# EAGLE schematic Electronics_schematic_v4 (EAGLE 9.7.0)
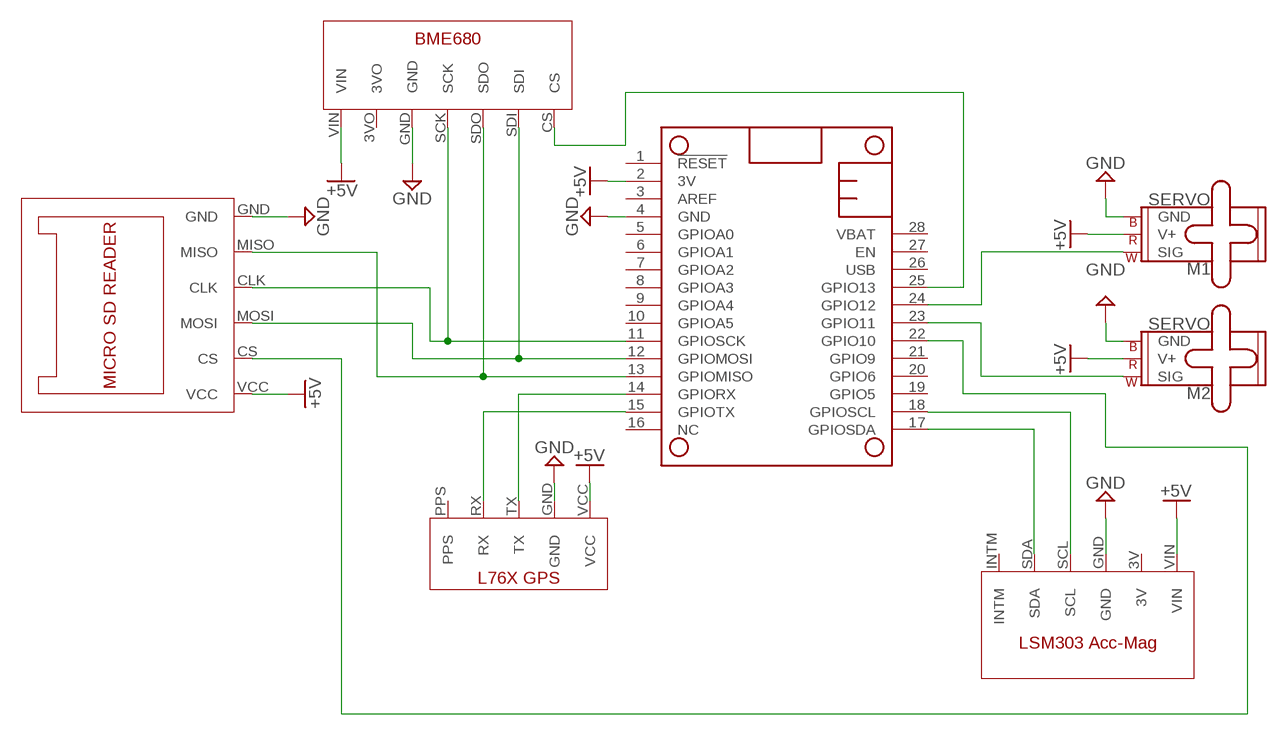
[diagram p0: schematic, sheet 1]

## Parts
M1  SERVO  [1X03]
M2  SERVO  [1X03]
MS1  FEATHERWING_NODIM  [FEATHERWING_DIM]
U$1  BME680  [BME680]
U$2  L76XGPS  [L76XGPS]
U$3  LSM303-ACC-MAG  [LSM303]
U$4  SD-READER  [SD-READER]

## Nets
+5V: M1.2(V+) M2.2(V+) MS1.2(3V) U$1.VIN U$2.VCC U$3.VIN
GND: M1.3(GND) M2.3(GND) MS1.4(GND) U$1.GND U$2.GND U$3.GND U$4.GND
N$1: MS1.11(GPIOSCK) U$1.SCK U$4.CLK
N$2: MS1.13(GPIOMISO) U$1.SDO U$4.MISO
N$3: MS1.12(GPIOMOSI) U$1.SDI U$4.MOSI
N$4: MS1.25(GPIO13) U$1.CS
N$5: MS1.14(GPIORX) U$2.TX
N$6: MS1.15(GPIOTX) U$2.RX
N$7: MS1.17(GPIOSDA) U$3.SDA
N$8: MS1.18(GPIOSCL) U$3.SCL
N$9: M1.1(SIG) MS1.24(GPIO12)
N$10: M2.1(SIG) MS1.23(GPIO11)
N$11: MS1.22(GPIO10) U$4.CS
VCC: U$4.VCC ; supply symbol labelled +5V
Unconnected: MS1.1(!RESET) MS1.3(AREF) MS1.5(GPIOA0) MS1.6(GPIOA1) MS1.7(GPIOA2) MS1.8(GPIOA3) MS1.9(GPIOA4) MS1.10(GPIOA5) MS1.16(NC) MS1.19(GPIO5) MS1.20(GPIO6) MS1.21(GPIO9) MS1.26(USB) MS1.27(EN) MS1.28(VBAT) U$1.3VO U$2.PPS U$3.3V U$3.INTM

## Library data of the parts
M1 M2 = SparkFun-Electromechanical:SERVO: Servo Motor 3-pin connector for a standard servo motor (voltage supply, ground, and control signal.) SparkFun Products Servo - Generic (Sub-Micro Size) <https://www.sparkfun.com/products/9065> (ROB-09065) Servo - Generic High Torque Continuous Rotation (Standard Size) <https://www.sparkfun.com/products/9347> (ROB-09347) Servo - Generic High Torque (Standard Size) <https://www.sparkfun.com/products/11965> (ROB-11965)
MS1 = adafruit:FEATHERWING
U$1 = Cansat PCB:BME680
U$2 = CanSat components:L76XGPS
U$3 = CanSat components:LSM303-ACC-MAG
U$4 = CanSat components:SD-READER